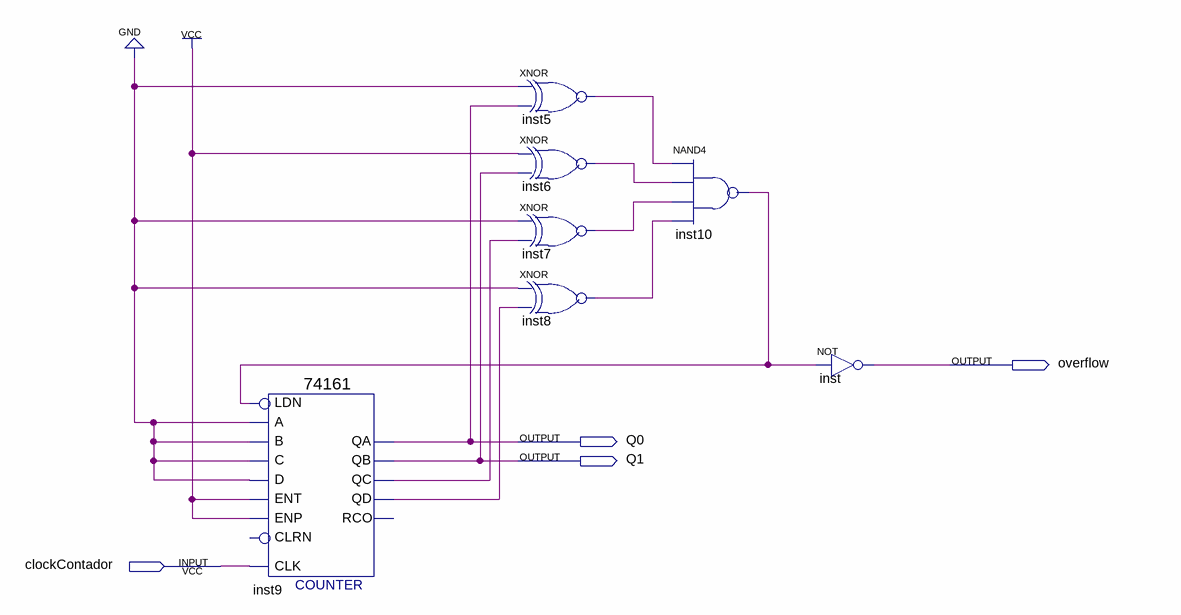
[diagram p0: schematic sheet]
// Quartus schematic 0a2.bdf as structural Verilog: 7 symbols, 4 pins
module \0a2  (
  input  clockContador,
  output overflow,
  output Q0,
  output Q1
);

  wire inst5_out, inst6_out, inst7_out, inst8_out, inst9_qc, inst9_qd, inst10_out;

  \74161  inst9 (
    .CLK(clockContador), .ENP(1'b1), .LDN(inst10_out), .A(1'b0), .D(1'b0), .ENT(1'b1), .B(1'b0), .C(1'b0),
    .QD(inst9_qd), .QC(inst9_qc), .QB(Q1), .QA(Q0));  // open: CLRN, RCO
  xnor inst5 (inst5_out, 1'b0, Q0);
  xnor inst6 (inst6_out, 1'b1, Q1);
  xnor inst7 (inst7_out, 1'b0, inst9_qc);
  xnor inst8 (inst8_out, 1'b0, inst9_qd);
  nand inst10 (inst10_out, inst5_out, inst6_out, inst7_out, inst8_out);
  not inst (overflow, inst10_out);
endmodule
